# Altium schematic sheet car board ver1.SchDoc
size A2
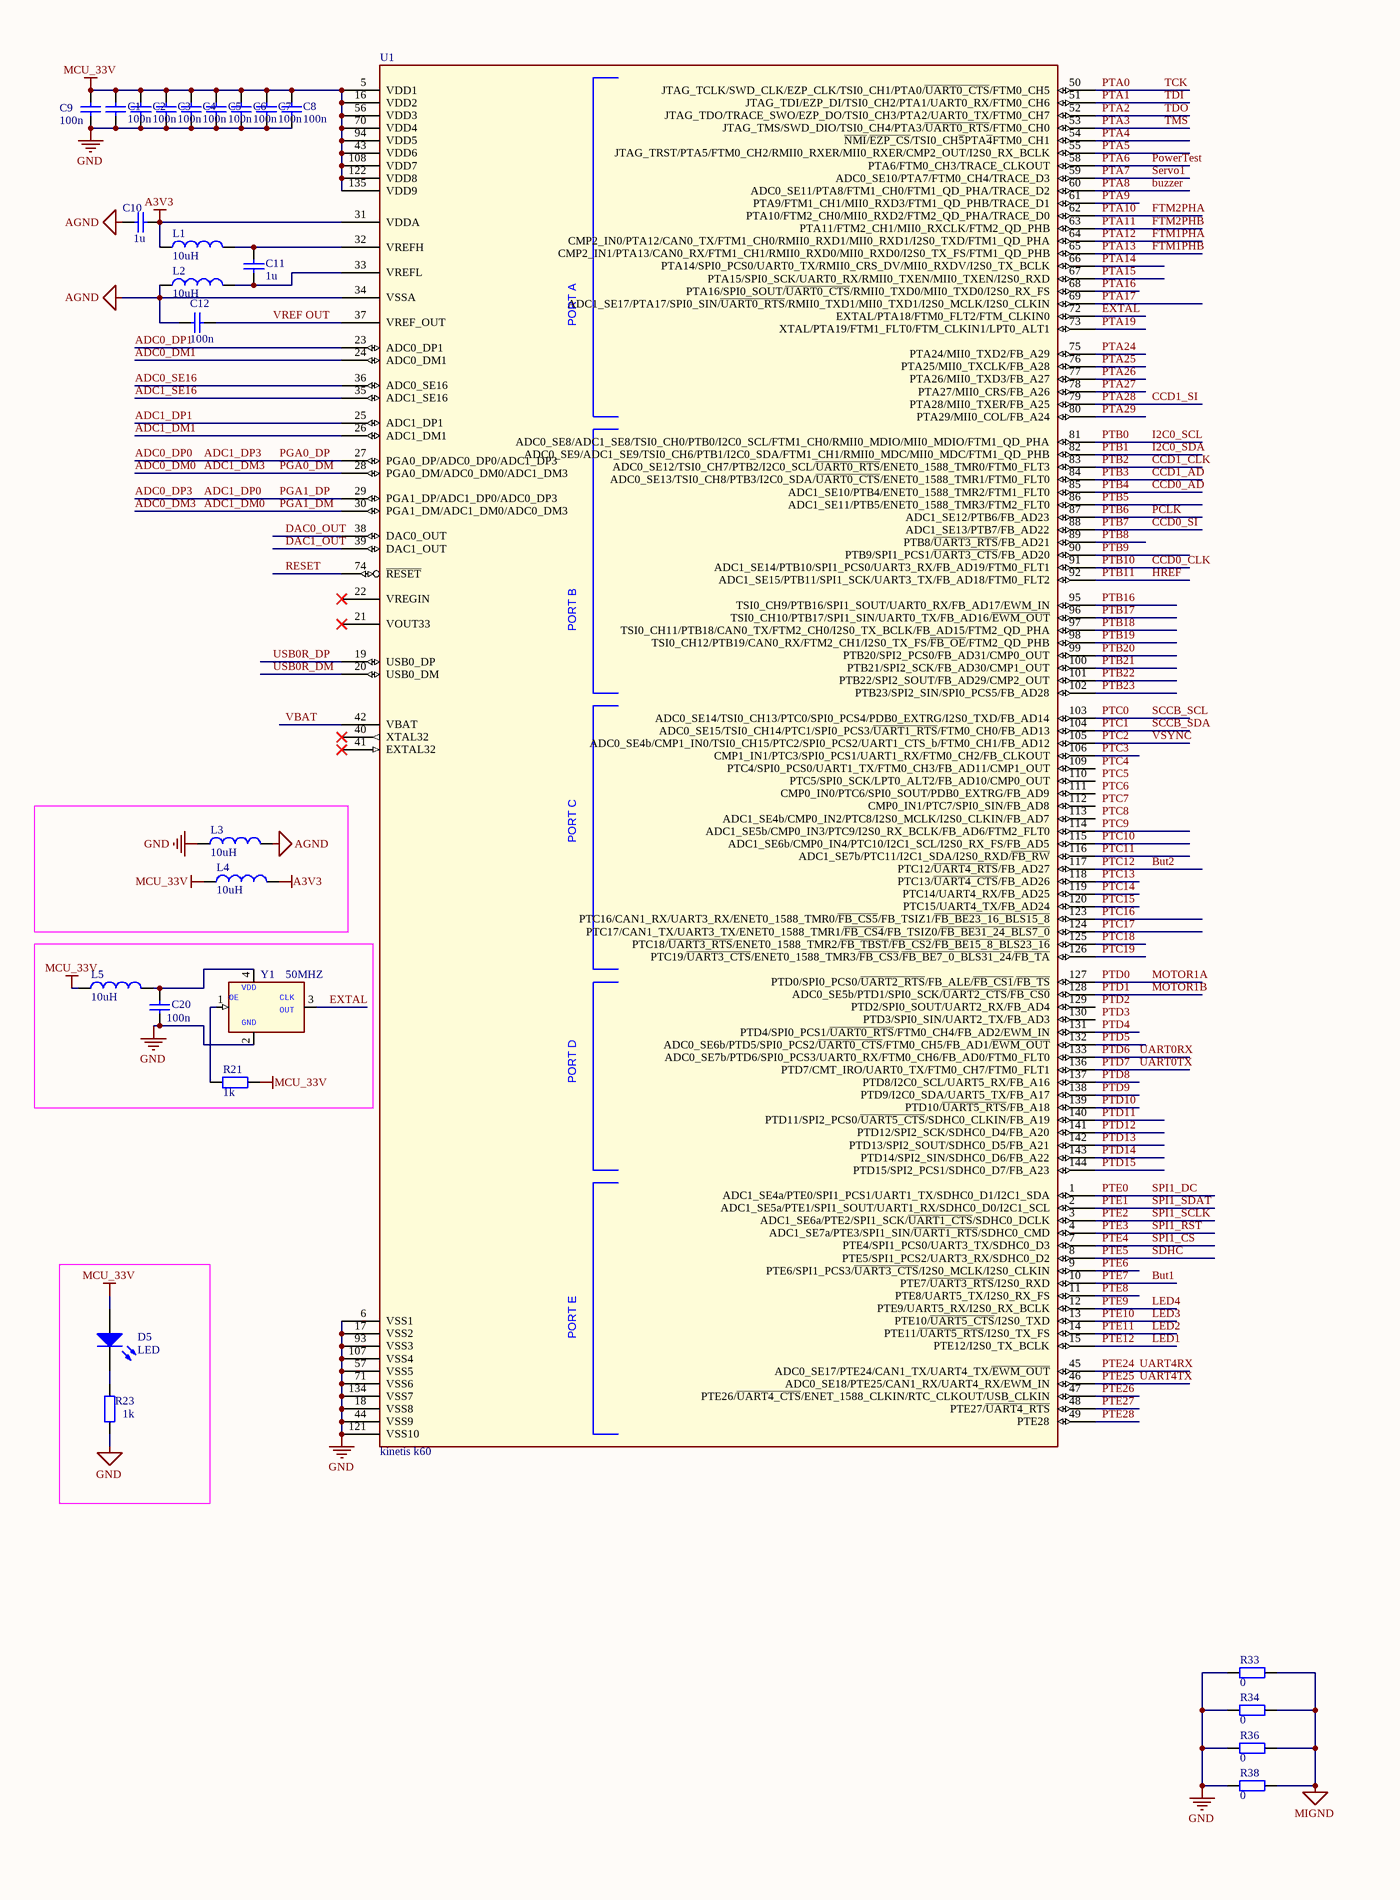
[diagram p0: car board ver1.SchDoc, left]
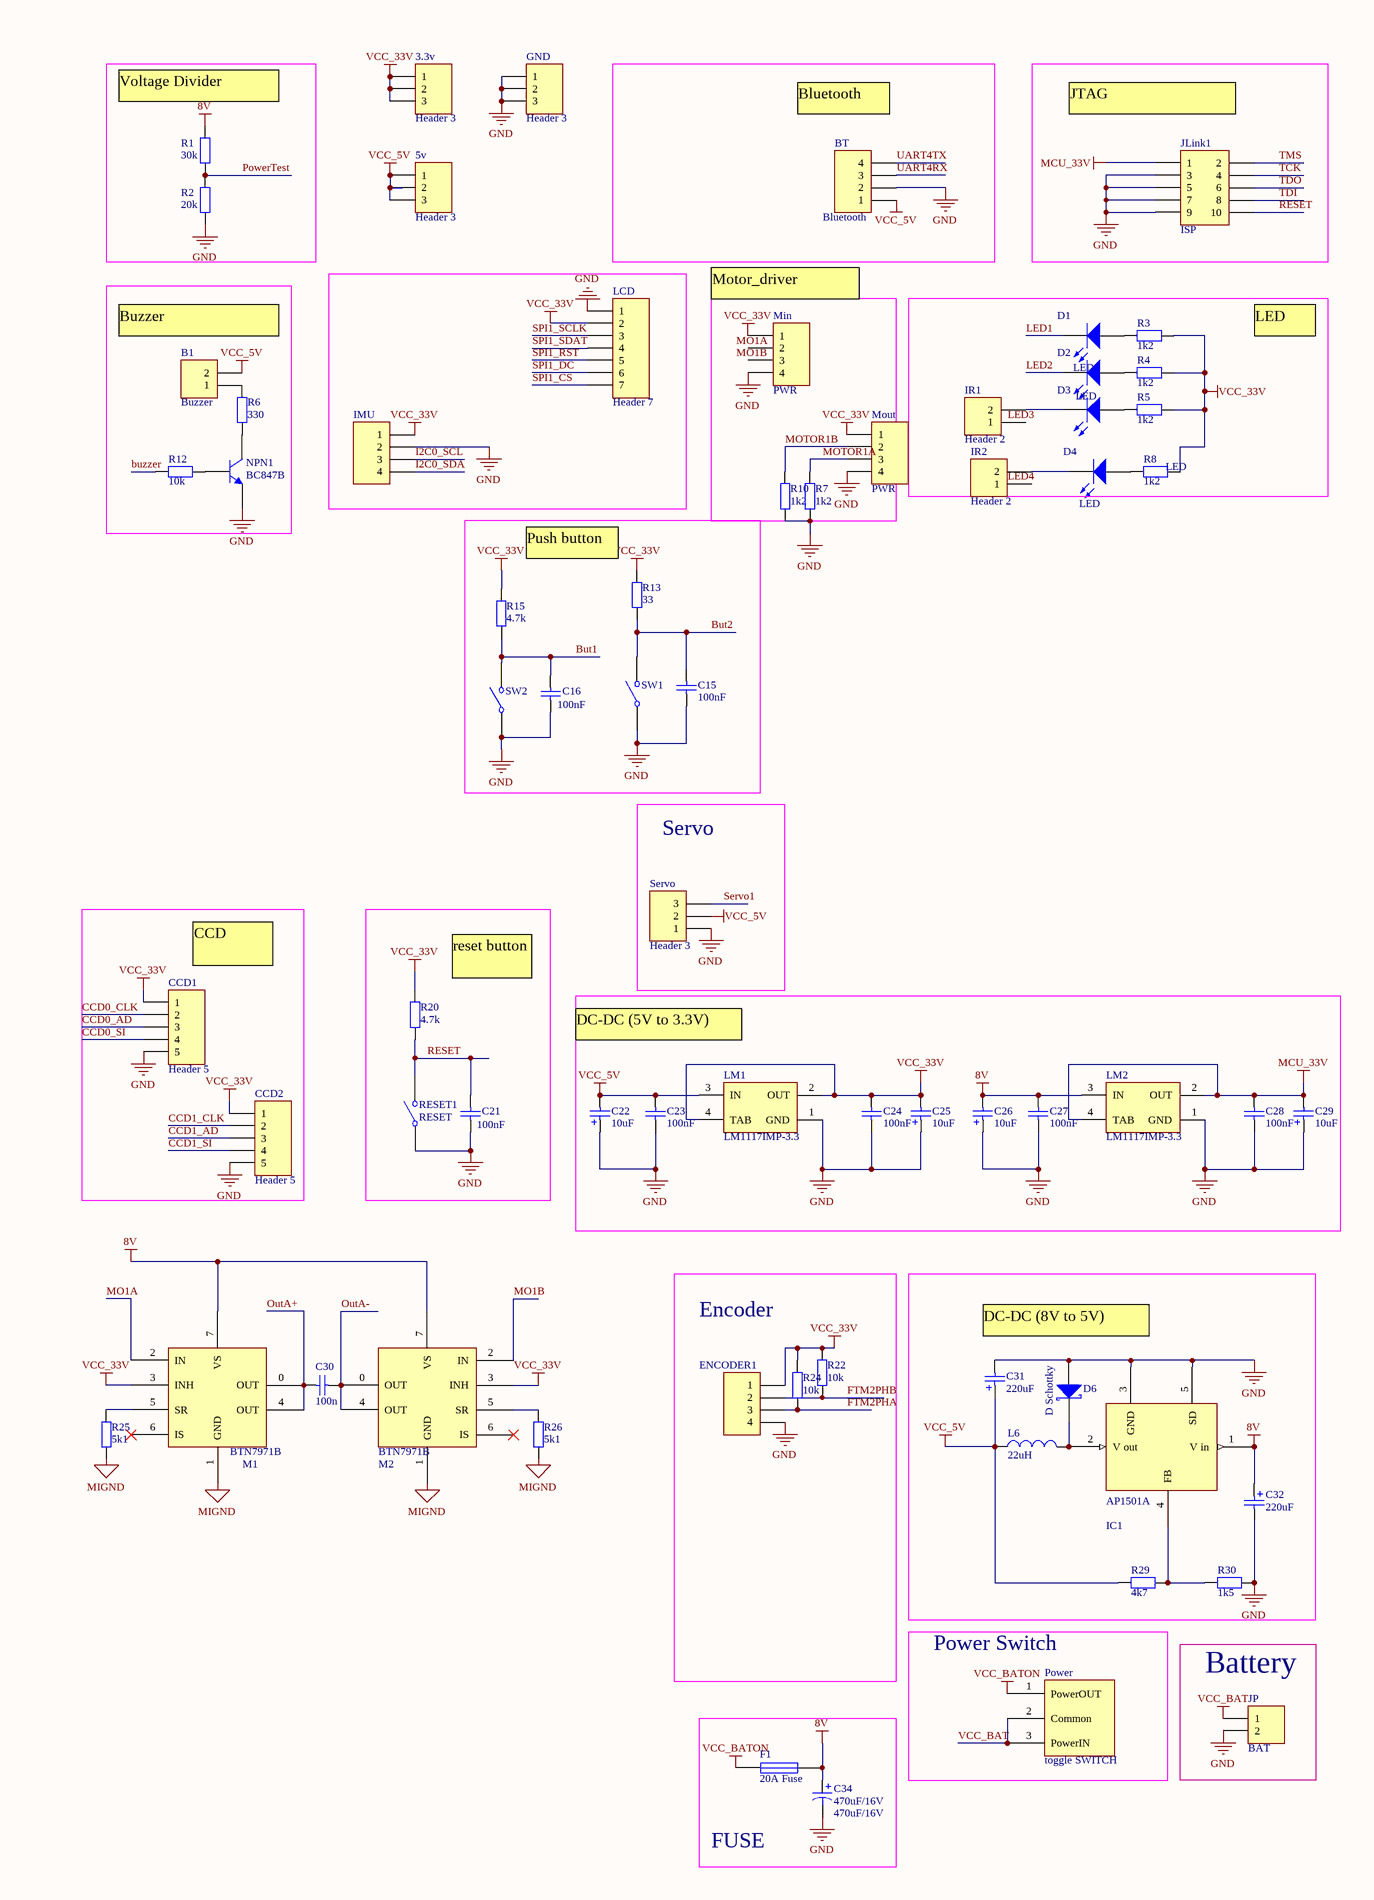
[diagram p1: car board ver1.SchDoc, right]

## Parts
3.3v  Header 3  [HDR1X3]
5v  Header 3  [HDR1X3]
B1  Buzzer  [Buzzer]
BT  Bluetooth  [6410-04]
C1  100n  [CC2012-0805]
C2  100n  [CC2012-0805]
C3  100n  [CC2012-0805]
C4  100n  [CC2012-0805]
C5  100n  [CC2012-0805]
C6  100n  [CC2012-0805]
C7  100n  [CC2012-0805]
C8  100n  [CC2012-0805]
C9  100n  [CC2012-0805]
C10  1u  [CC2012-0805]
C11  1u  [CC2012-0805]
C12  100n  [CC2012-0805]
C15  100nF  [CC2012-0805]
C16  100nF  [CC2012-0805]
C20  100n  [CC2012-0805]
C21  100nF  [CC2012-0805]
C22  10uF  [CC2012-0805]
C23  100nF  [CC2012-0805]
C24  100nF  [CC2012-0805]
C25  10uF  [CC2012-0805]
C26  10uF  [CC2012-0805]
C27  100nF  [CC2012-0805]
C28  100nF  [CC2012-0805]
C29  10uF  [CC2012-0805]
C30  100n  [CC2012-0805]
C31  220uF  [CAPC7238N]
C32  220uF  [CAPC7238N]
C34  470uF/16V  [SV-G]
CCD1  Header 5  [HDR1X5]
CCD2  Header 5  [HDR1X5]
D1  LED  [SMD _LED]
D2  LED  [SMD _LED]
D3  LED  [SMD _LED]
D4  LED  [SMD _LED]
D5  LED  [SMD _LED]
D6  D Schottky  [SMC]
ENCODER1  (no value)  [6410-04]
F1  20A Fuse  [FUSE]
GND  Header 3  [HDR1X3]
IC1  AP1501A  [TO-263(5)]
IMU  (no value)  [6410-04]
IR1  Header 2  [6410-02]
IR2  Header 2  [6410-02]
JLink1  ISP  [HDR2X5]
JP  BAT  [T-CONNECTOR (M)]
L1  10uH  [CR3225-1210]
L2  10uH  [CR3225-1210]
L3  10uH  [CR3225-1210]
L4  10uH  [CR3225-1210]
L5  10uH  [CR3225-1210]
L6  22uH  [CR3225-1210]
LCD  Header 7  [HDR1X7]
LM1  LM1117IMP-3.3  [MP04A_M]
LM2  LM1117IMP-3.3  [MP04A_M]
M1  BTN7971B  [TO-263(7)]
M2  BTN7971B  [TO-263(7)]
Min  PWR  [HDR1X4]
Mout  PWR  [HDR1X4]
NPN1  BC847B  [SOT-23]
Power  toggle SWITCH  [ToggleSwitch]
R1  30k  [CR2012-0805]
R2  20k  [CR2012-0805]
R3  1k2  [CR2012-0805]
R4  1k2  [CR2012-0805]
R5  1k2  [CR2012-0805]
R6  330  [CR2012-0805]
R7  1k2  [CR2012-0805]
R8  1k2  [CR2012-0805]
R10  1k2  [CR2012-0805]
R12  10k  [CR2012-0805]
R13  33  [CR2012-0805]
R15  value 4.7k  [CR2012-0805]  (hidden comment: 4k7)
R20  value 4.7k  [CR2012-0805]  (hidden comment: 4k7)
R21  1k  [CR2012-0805]
R22  10k  [CR2012-0805]
R23  1k  [CR2012-0805]
R24  10k  [CR2012-0805]
R25  5k1  [CR2012-0805]
R26  5k1  [CR2012-0805]
R29  4k7  [CR2012-0805]
R30  1k5  [CR2012-0805]
R33  0  [CR2012-0805]
R34  0  [CR2012-0805]
R36  0  [CR2012-0805]
R38  0  [CR2012-0805]
RESET1  RESET  [PUSHBUTTOM]
Servo  Header 3  [6410-03]
SW1  (no value)  [PUSHBUTTOM]
SW2  (no value)  [PUSHBUTTOM]
U1  kinetis k60  [LQFP50P2200X2200X160-144M]
Y1  50MHZ  [XTLOSC4_SM]

## Blocks framed on the sheet
Servo: Servo
Encoder: ENCODER1 R22 R24
Power Switch: Power
Battery: JP
FUSE: C34 F1

## Nets
8V: C26.2 C27.2 C32.1 C34.1 F1.2 IC1.1(V_in) LM2.3(IN) M1.7(VS) M2.7(VS) R1.2
A3V3: C10.2 L1.1 L4.2 U1.31(VDDA)
AGND: C10.1 C12.1 L2.1 L3.2 U1.34(VSSA)
GND: BT.2 C1.1 C2.1 C3.1 C4.1 C5.1 C6.1 C7.1 C8.1 C9.1 C15.1 C16.1 C20.2 C21.1 C22.1 C23.1 C24.1 C25.1 C26.1 C27.1 C28.1 C29.1 C31.2 C32.2 C34.2 CCD1.5 CCD2.5 D6.1(A) ENCODER1.4 GND.1 GND.2 GND.3 IC1.3(GND) IC1.5(SD) IMU.2 JLink1.3 JLink1.5 JLink1.7 JLink1.9 JP.2 L3.1 LCD.1 LM1.1(GND) LM2.1(GND) Min.4 Mout.4 NPN1.1(E) R2.1 R7.1 R10.1 R23.2 R30.2 R33.1 R34.1 R36.1 R38.1 RESET1.1(COMMON) Servo.1 SW1.1(COMMON) SW2.1(COMMON) U1.6(VSS1) U1.17(VSS2) U1.18(VSS8) U1.44(VSS9) U1.57(VSS5) U1.71(VSS6) U1.93(VSS3) U1.107(VSS4) U1.121(VSS10) U1.134(VSS7) Y1.2(GND)
MCU_33V: C1.2 C2.2 C3.2 C4.2 C5.2 C6.2 C7.2 C8.2 C9.2 C28.2 C29.2 D5.1(A) JLink1.1 L4.1 L5.1 LM2.2(OUT) LM2.4(TAB) R21.2 U1.5(VDD1) U1.16(VDD2) U1.43(VDD6) U1.56(VDD3) U1.70(VDD4) U1.94(VDD5) U1.108(VDD7) U1.122(VDD8) U1.135(VDD9)
MIGND: M1.1(GND) M2.1(GND) R25.1 R26.1 R33.2 R34.2 R36.2 R38.2
VCC_5V: 5v.1 5v.2 5v.3 B1.2 BT.1 C22.2 C23.2 C31.1 L6.1 LM1.3(IN) R29.1 Servo.2
VCC_33V: 3.3v.1 3.3v.2 3.3v.3 C24.2 C25.2 CCD1.1 CCD2.1 ENCODER1.1 IMU.1 LCD.2 LM1.2(OUT) LM1.4(TAB) M1.3(INH) M2.3(INH) Min.1 Mout.1 R3.2 R4.2 R5.2 R8.2 R13.1 R15.1 R20.1 R22.2 R24.2
VCC_BAT: JP.1 Power.2(Common) Power.3(PowerIN)
VCC_BATON: F1.1 Power.1(PowerOUT)
ADC0_DM0: U1.28(PGA0_DM/ADC0_DM0/ADC1_DM3)  [also labelled ADC1_DM3, PGA0_DM]
ADC0_DM1: U1.24(ADC0_DM1)
ADC0_DM3: U1.30(PGA1_DM/ADC1_DM0/ADC0_DM3)  [also labelled ADC1_DM0, PGA1_DM]
ADC0_DP0: U1.27(PGA0_DP/ADC0_DP0/ADC1_DP3)  [also labelled ADC1_DP3, PGA0_DP]
ADC0_DP1: U1.23(ADC0_DP1)
ADC0_DP3: U1.29(PGA1_DP/ADC1_DP0/ADC0_DP3)  [also labelled ADC1_DP0, PGA1_DP]
ADC0_SE16: U1.36(ADC0_SE16)
ADC1_DM1: U1.26(ADC1_DM1)
ADC1_DP1: U1.25(ADC1_DP1)
ADC1_SE16: U1.35(ADC1_SE16)
But1: C16.2 R15.2 SW2.2(NO) U1.10(PTE7/~{UART3_RTS}/I2S0_RXD)  [also labelled PTE7]
But2: C15.2 R13.2 SW1.2(NO) U1.117(PTC12/~{UART4_RTS}/FB_AD27)  [also labelled PTC12]
buzzer: R12.1 U1.60(ADC0_SE11/PTA8/FTM1_CH0/FTM1_QD_PHA/TRACE_D2)  [also labelled PTA8]
CCD0_AD: CCD1.3 U1.85(ADC1_SE10/PTB4/ENET0_1588_TMR2/FTM1_FLT0)  [also labelled PTB4]
CCD0_CLK: CCD1.2 U1.91(ADC1_SE14/PTB10/SPI1_PCS0/UART3_RX/FB_AD19/FTM0_FLT1)  [also labelled PTB10]
CCD0_SI: CCD1.4 U1.88(ADC1_SE13/PTB7/FB_AD22)  [also labelled PTB7]
CCD1_AD: CCD2.3 U1.84(ADC0_SE13/TSI0_CH8/PTB3/I2C0_SDA/~{UART0_CTS}/ENET0_1588_TMR1/FTM0_FLT0)  [also labelled PTB3]
CCD1_CLK: CCD2.2 U1.83(ADC0_SE12/TSI0_CH7/PTB2/I2C0_SCL/~{UART0_RTS}/ENET0_1588_TMR0/FTM0_FLT3)  [also labelled PTB2]
CCD1_SI: CCD2.4 U1.79(PTA28/MII0_TXER/FB_A25)  [also labelled PTA28]
DAC0_OUT: U1.38(DAC0_OUT)
DAC1_OUT: U1.39(DAC1_OUT)
EXTAL: U1.72(EXTAL/PTA18/FTM0_FLT2/FTM_CLKIN0) Y1.3(CLKOUT)
FTM1PHA: U1.64(CMP2_IN0/PTA12/CAN0_TX/FTM1_CH0/RMII0_RXD1/MII0_RXD1/I2S0_TXD/FTM1_QD_PHA)  [also labelled PTA12]
FTM1PHB: U1.65(CMP2_IN1/PTA13/CAN0_RX/FTM1_CH1/RMII0_RXD0/MII0_RXD0/I2S0_TX_FS/FTM1_QD_PHB)  [also labelled PTA13]
FTM2PHA: ENCODER1.3 R24.1 U1.62(PTA10/FTM2_CH0/MII0_RXD2/FTM2_QD_PHA/TRACE_D0)  [also labelled PTA10]
FTM2PHB: ENCODER1.2 R22.1 U1.63(PTA11/FTM2_CH1/MII0_RXCLK/FTM2_QD_PHB)  [also labelled PTA11]
HREF: U1.92(ADC1_SE15/PTB11/SPI1_SCK/UART3_TX/FB_AD18/FTM0_FLT2)  [also labelled PTB11]
I2C0_SCL: IMU.3 U1.81(ADC0_SE8/ADC1_SE8/TSI0_CH0/PTB0/I2C0_SCL/FTM1_CH0/RMII0_MDIO/MII0_MDIO/FTM1_QD_PHA)  [also labelled PTB0]
I2C0_SDA: IMU.4 U1.82(ADC0_SE9/ADC1_SE9/TSI0_CH6/PTB1/I2C0_SDA/FTM1_CH1/RMII0_MDC/MII0_MDC/FTM1_QD_PHB)  [also labelled PTB1]
LED1: D1.2(K) U1.15(PTE12/I2S0_TX_BCLK)  [also labelled PTE12]
LED2: D2.2(K) U1.14(PTE11/~{UART5_RTS}/I2S0_TX_FS)  [also labelled PTE11]
LED3: U1.13(PTE10/~{UART5_CTS}/I2S0_TXD)  [also labelled PTE10]
LED4: U1.12(PTE9/UART5_RX/I2S0_RX_BCLK)  [also labelled PTE9]
MO1A: M1.2(IN)
MO1B: M2.2(IN)
MOTOR1A: Mout.3 R7.2 U1.127(PTD0/SPI0_PCS0/~{UART2_RTS}/FB_ALE/~{FB_CS1}/~{FB_TS})  [also labelled PTD0]
MOTOR1B: Mout.2 R10.2 U1.128(ADC0_SE5b/PTD1/SPI0_SCK/~{UART2_CTS}/~{FB_CS0})  [also labelled PTD1]
OutA+: C30.1 M1.0(OUT) M1.4(OUT)
OutA-: C30.2 M2.0(OUT) M2.4(OUT)
PCLK: U1.87(ADC1_SE12/PTB6/FB_AD23)  [also labelled PTB6]
PowerTest: R1.1 R2.2 U1.58(PTA6/FTM0_CH3/TRACE_CLKOUT)  [also labelled PTA6]
PTA0: JLink1.4 U1.50(JTAG_TCLK/SWD_CLK/EZP_CLK/TSI0_CH1/PTA0/~{UART0_CTS}/FTM0_CH5)  [also labelled TCK]
PTA1: JLink1.8 U1.51(JTAG_TDI/EZP_DI/TSI0_CH2/PTA1/UART0_RX/FTM0_CH6)  [also labelled TDI]
PTA2: JLink1.6 U1.52(JTAG_TDO/TRACE_SWO/EZP_DO/TSI0_CH3/PTA2/UART0_TX/FTM0_CH7)  [also labelled TDO]
PTA3: JLink1.2 U1.53(JTAG_TMS/SWD_DIO/TSI0_CH4/PTA3/~{UART0_RTS}/FTM0_CH0)  [also labelled TMS]
PTA4: U1.54(~{NMI}/~{EZP_CS}/TSI0_CH~{5}PTA~{4}FTM0_CH1)
PTA5: U1.55(JTAG_TRST/PTA5/FTM0_CH2/RMII0_RXER/MII0_RXER/CMP2_OUT/I2S0_RX_BCLK)
PTA7: Servo.3 U1.59(ADC0_SE10/PTA7/FTM0_CH4/TRACE_D3)  [also labelled Servo1]
PTA9: U1.61(PTA9/FTM1_CH1/MII0_RXD3/FTM1_QD_PHB/TRACE_D1)
PTA14: U1.66(PTA14/SPI0_PCS0/UART0_TX/RMII0_CRS_DV/MII0_RXDV/I2S0_TX_BCLK)
PTA15: U1.67(PTA15/SPI0_SCK/UART0_RX/RMII0_TXEN/MII0_TXEN/I2S0_RXD)
PTA16: U1.68(PTA16/SPI0_SOUT/~{UART0_CTS}/RMII0_TXD0/MII0_TXD0/I2S0_RX_FS)
PTA17: U1.69(ADC1_SE17/PTA17/SPI0_SIN/~{UART0_RTS}/RMII0_TXD1/MII0_TXD1/I2S0_MCLK/I2S0_CLKIN)
PTA19: U1.73(XTAL/PTA19/FTM1_FLT0/FTM_CLKIN1/LPT0_ALT1)
PTA24: U1.75(PTA24/MII0_TXD2/FB_A29)
PTA25: U1.76(PTA25/MII0_TXCLK/FB_A28)
PTA26: U1.77(PTA26/MII0_TXD3/FB_A27)
PTA27: U1.78(PTA27/MII0_CRS/FB_A26)
PTA29: U1.80(PTA29/MII0_COL/FB_A24)
PTB5: U1.86(ADC1_SE11/PTB5/ENET0_1588_TMR3/FTM2_FLT0)
PTB8: U1.89(PTB8/~{UART3_RTS}/FB_AD21)
PTB9: U1.90(PTB9/SPI1_PCS1/~{UART3_CTS}/FB_AD20)
PTB16: U1.95(TSI0_CH9/PTB16/SPI1_SOUT/UART0_RX/FB_AD17/EWM_IN)
PTB17: U1.96(TSI0_CH10/PTB17/SPI1_SIN/UART0_TX/FB_AD16/~{EWM_OUT})
PTB18: U1.97(TSI0_CH11/PTB18/CAN0_TX/FTM2_CH0/I2S0_TX_BCLK/FB_AD15/FTM2_QD_PHA)
PTB19: U1.98(TSI0_CH12/PTB19/CAN0_RX/FTM2_CH1/I2S0_TX_FS/~{FB_OE}/FTM2_QD_PHB)
PTB20: U1.99(PTB20/SPI2_PCS0/FB_AD31/CMP0_OUT)
PTB21: U1.100(PTB21/SPI2_SCK/FB_AD30/CMP1_OUT)
PTB22: U1.101(PTB22/SPI2_SOUT/FB_AD29/CMP2_OUT)
PTB23: U1.102(PTB23/SPI2_SIN/SPI0_PCS5/FB_AD28)
PTC0: U1.103(ADC0_SE14/TSI0_CH13/PTC0/SPI0_PCS4/PDB0_EXTRG/I2S0_TXD/FB_AD14)  [also labelled SCCB_SCL]
PTC1: U1.104(ADC0_SE15/TSI0_CH14/PTC1/SPI0_PCS3/~{UART1_RTS}/FTM0_CH0/FB_AD13)  [also labelled SCCB_SDA]
PTC2: U1.105(ADC0_SE4b/CMP1_IN0/TSI0_CH15/PTC2/SPI0_PCS2/UART1_CTS_b/FTM0_CH1/FB_AD12)  [also labelled VSYNC]
PTC3: U1.106(CMP1_IN1/PTC3/SPI0_PCS1/UART1_RX/FTM0_CH2/FB_CLKOUT)
PTC9: U1.114(ADC1_SE5b/CMP0_IN3/PTC9/I2S0_RX_BCLK/FB_AD6/FTM2_FLT0)
PTC10: U1.115(ADC1_SE6b/CMP0_IN4/PTC10/I2C1_SCL/I2S0_RX_FS/FB_AD5)
PTC11: U1.116(ADC1_SE7b/PTC11/I2C1_SDA/I2S0_RXD/~{FB_RW})
PTC13: U1.118(PTC13/~{UART4_CTS}/FB_AD26)
PTC14: U1.119(PTC14/UART4_RX/FB_AD25)
PTC15: U1.120(PTC15/UART4_TX/FB_AD24)
PTC16: U1.123(PTC16/CAN1_RX/UART3_RX/ENET0_1588_TMR0/~{FB_CS5}/FB_TSIZ1/~{FB_BE23_16_BLS15_8})
PTC17: U1.124(PTC17/CAN1_TX/UART3_TX/ENET0_1588_TMR1/~{FB_CS4}/FB_TSIZ0/~{FB_BE31_24_BLS7_0})
PTC18: U1.125(PTC18/~{UART3_RTS}/ENET0_1588_TMR2/~{FB_TBST}/~{FB_CS2}/~{FB_BE15_8_BLS23_16})
PTC19: U1.126(PTC19/~{UART3_CTS}/ENET0_1588_TMR3/~{FB_CS3}/~{FB_BE7_0_BLS31_24}/~{FB_TA})
PTD4: U1.131(PTD4/SPI0_PCS1/~{UART0_RTS}/FTM0_CH4/FB_AD2/EWM_IN)
PTD5: U1.132(ADC0_SE6b/PTD5/SPI0_PCS2/~{UART0_CTS}/FTM0_CH5/FB_AD1/~{EWM_OUT})
PTD6: U1.133(ADC0_SE7b/PTD6/SPI0_PCS3/UART0_RX/FTM0_CH6/FB_AD0/FTM0_FLT0)  [also labelled UART0RX]
PTD7: U1.136(PTD7/CMT_IRO/UART0_TX/FTM0_CH7/FTM0_FLT1)  [also labelled UART0TX]
PTD8: U1.137(PTD8/I2C0_SCL/UART5_RX/FB_A16)
PTD9: U1.138(PTD9/I2C0_SDA/UART5_TX/FB_A17)
PTD10: U1.139(PTD10/~{UART5_RTS}/FB_A18)
PTD11: U1.140(PTD11/SPI2_PCS0/~{UART5_CTS}/SDHC0_CLKIN/FB_A19)
PTD12: U1.141(PTD12/SPI2_SCK/SDHC0_D4/FB_A20)
PTD13: U1.142(PTD13/SPI2_SOUT/SDHC0_D5/FB_A21)
PTD14: U1.143(PTD14/SPI2_SIN/SDHC0_D6/FB_A22)
PTD15: U1.144(PTD15/SPI2_PCS1/SDHC0_D7/FB_A23)
PTE0: LCD.6 U1.1(ADC1_SE4a/PTE0/SPI1_PCS1/UART1_TX/SDHC0_D1/I2C1_SDA)  [also labelled SPI1_DC]
PTE1: LCD.4 U1.2(ADC1_SE5a/PTE1/SPI1_SOUT/UART1_RX/SDHC0_D0/I2C1_SCL)  [also labelled SPI1_SDAT]
PTE2: LCD.3 U1.3(ADC1_SE6a/PTE2/SPI1_SCK/~{UART1_CTS}/SDHC0_DCLK)  [also labelled SPI1_SCLK]
PTE3: LCD.5 U1.4(ADC1_SE7a/PTE3/SPI1_SIN/~{UART1_RTS}/SDHC0_CMD)  [also labelled SPI1_RST]
PTE4: LCD.7 U1.7(PTE4/SPI1_PCS0/UART3_TX/SDHC0_D3)  [also labelled SPI1_CS]
PTE5: U1.8(PTE5/SPI1_PCS2/UART3_RX/SDHC0_D2)  [also labelled SDHC]
PTE6: U1.9(PTE6/SPI1_PCS3/~{UART3_CTS}/I2S0_MCLK/I2S0_CLKIN)
PTE8: U1.11(PTE8/UART5_TX/I2S0_RX_FS)
PTE24: BT.3 U1.45(ADC0_SE17/PTE24/CAN1_TX/UART4_TX/~{EWM_OUT})  [also labelled UART4RX]
PTE25: BT.4 U1.46(ADC0_SE18/PTE25/CAN1_RX/UART4_RX/EWM_IN)  [also labelled UART4TX]
PTE26: U1.47(PTE26/~{UART4_CTS}/ENET_1588_CLKIN/RTC_CLKOUT/USB_CLKIN)
PTE27: U1.48(PTE27/~{UART4_RTS})
PTE28: U1.49(PTE28)
RESET: C21.2 JLink1.10 R20.2 RESET1.2(NO) U1.74(~{RESET})
USB0R_DM: U1.20(USB0_DM)
USB0R_DP: U1.19(USB0_DP)
VBAT: U1.42(VBAT)
VREF OUT: C12.2 U1.37(VREF_OUT)
NetB1_1: B1.1 R6.1
NetC11_1: C11.1 L2.2 U1.33(VREFL)
NetC11_2: C11.2 L1.2 U1.32(VREFH)
NetC20_1: C20.1 L5.2 Y1.4(VDD)
NetD1_1: D1.1(A) R3.1
NetD2_1: D2.1(A) R4.1
NetD3_1: D3.1(A) R5.1
NetD3_2: D3.2(K) IR1.2
NetD4_1: D4.1(A) R8.1
NetD4_2: D4.2(K) IR2.2
NetD5_2: D5.2(K) R23.1
NetD6_2: D6.2(K) IC1.2(V_out) L6.2
NetIC1_4: IC1.4(FB) R29.2 R30.1
NetM1_5: M1.5(SR) R25.2
NetM2_5: M2.5(SR) R26.2
NetNPN1_2: NPN1.2(B) R12.2
NetNPN1_3: NPN1.3(C) R6.2
NetR21_1: R21.1 Y1.1(OE)

Not connected (* = marked no-connect by the designer): IR1 1; IR2 1; M1 6(IS)*; M2 6(IS)*; Min 2 3; U1 21(VOUT33)* 22(VREGIN)* 40(XTAL32)* 41(EXTAL32)* 109(PTC4/SPI0_PCS0/UART1_TX/FTM0_CH3/FB_AD11/CMP1_OUT) 110(PTC5/SPI0_SCK/LPT0_ALT2/FB_AD10/CMP0_OUT) 111(CMP0_IN0/PTC6/SPI0_SOUT/PDB0_EXTRG/FB_AD9) 112(CMP0_IN1/PTC7/SPI0_SIN/FB_AD8) 113(ADC1_SE4b/CMP0_IN2/PTC8/I2S0_MCLK/I2S0_CLKIN/FB_AD7) 129(PTD2/SPI0_SOUT/UART2_RX/FB_AD4) 130(PTD3/SPI0_SIN/UART2_TX/FB_AD3)

## Notes on the sheet
- (near R1) Voltage Divider
- Bluetooth
- JTAG
- (near B1) Buzzer
- (near Min) Motor_driver
- LED
- Push button
- (near CCD1) CCD
- (near R20) reset button
- DC-DC (5V to 3.3V)
- DC-DC (8V to 5V)
- Labels drawn without touching a wire or pin: LED3, LED4, MO1A, MO1B, PTC4, PTC5, PTC6, PTC7, PTC8, PTD2, PTD3
- (in symbol CLKGEN-SM) CLK; OUT
- (in symbol kinetis k60) PORT A; PORT B; PORT C; PORT D; PORT E

## Library data of the parts
3.3v 5v GND Servo = Header 3: Header, 3-Pin; LatestRevisionDate: 17-Jul-2002; LatestRevisionNote: Re-released for DXP Platform.; Publisher: Altium Limited
BT ENCODER1 IMU Min Mout = Header 4: Header, 4-Pin; Publisher: Altium Limited
  BT Min Mout: LatestRevisionDate: 17-Jul-2002; LatestRevisionNote: Re-released for DXP Platform.
  ENCODER1 IMU: Revision: 17-Jul-2002: Re-released for DXP Platform.
C1-C12 C15 C16 C20 C21 C23 C24 C27 C28 = Cap Semi: Capacitor (Semiconductor SIM Model); Published: 8-Jun-2000; LatestRevisionDate: 17-Jul-2002; LatestRevisionNote: Re-released for DXP Platform.; PackageReference: C1206; Publisher: Altium Limited
  C16 C21: value: 100nF
C22 C25 C26 C29 = Cap Pol3: Polarized Capacitor (Surface Mount); Published: 8-Jun-2000; LatestRevisionDate: 17-Jul-2002; LatestRevisionNote: Re-released for DXP Platform.; PackageReference: C0805; Publisher: Altium Limited
C30 = Cap: Capacitor; Published: 8-Jun-2000; LatestRevisionDate: 17-Jul-2002; LatestRevisionNote: Re-released for DXP Platform.; Publisher: Altium Limited
C31 C32 = Cap Pol1: Polarized Capacitor (Radial); Published: 8-Jun-2000; LatestRevisionDate: 17-Jul-2002; LatestRevisionNote: Re-released for DXP Platform.; Publisher: Altium Limited
C34 = Cap Pol2: Polarized Capacitor (Axial); Published: 8-Jun-2000; Revision: July-2002: Re-released for DXP Platform.; Publisher: Altium Limited; Value: 470uF/16V
CCD1 CCD2 = Header 5: Header, 5-Pin; LatestRevisionDate: 17-Jul-2002; LatestRevisionNote: Re-released for DXP Platform.; Publisher: Altium Limited
D1-D5 = LED: Typical RED GaAs LED; Published: 8-Jun-2000; LatestRevisionDate: 08-Jul-2005; LatestRevisionNote: Mech Layer 1 removed.; PackageReference: LED-1; Publisher: Altium Limited
D6 = D Schottky: Schottky Diode; Code - JEDEC: DO-214-AA; Published: 8-Jun-2000; Revision: July-2002: Re-released for DXP Platform.; Publisher: Altium Limited
F1 = Fuse: Published: 8-Jun-2000; Revision: July-2002: Re-released for DXP Platform.; Publisher: Altium Limited
IC1 = AP1501A: 5A Step-Down Switching Mode Voltage Regulator
IR1 IR2 JP = Header 2: Header, 2-Pin; Publisher: Altium Limited
  IR1 IR2: LatestRevisionDate: 17-Jul-2002; LatestRevisionNote: Re-released for DXP Platform.
  JP: Revision: 17-Jul-2002: Re-released for DXP Platform.
JLink1 = Header 5X2: Header, 5-Pin, Dual row; Revision: 17-Jul-2002: Re-released for DXP Platform.; Publisher: Altium Limited
L1-L6 = Inductor: Published: 8-Jun-2000; Revision: July-2002: Re-released for DXP Platform.; Publisher: Altium Limited
  L1-L5: Value: 10uH
  L6: Value: 22uH
LCD = Header 7: Header, 7-Pin; LatestRevisionDate: 17-Jul-2002; LatestRevisionNote: Re-released for DXP Platform.; Publisher: Altium Limited
LM1 LM2 = LM1117IMP-3.3: 800mA Low-Dropout Linear Regulator; Manufacturer: National Semiconductor; CompType: LDO IC; PackageTopMarking: XYTT*N05B; PowerWise: N; Published: 4-Dec-2008; DatasheetVersion: Apr-2006; PackageVersion: revB, Apr-2003; PackageReference: MP04A; Publisher: Altium Limited; PackageDescription: Molded SOT-223, 6.50 x 3.56 x 1.6mm Body, 4 Lead, 2.3mm Pitch; PartNumber: LM1117IMP-3.3; RoHS: O; PinCount: 4; DigiKeyPartNumber: LM1117IMP-3.3CT-ND; Code_JEDEC: TO-261-AA; Code_IPC: SOT223-4; ComponentLink1Description: LM1117 Datasheet; ComponentLink1URL: http://www.national.com/ds/LM/LM1117.pdf; ComponentLink2Description: LM1117 Web Page; ComponentLink2URL: http://www.national.com/pf/LM/LM1117.html; ComponentLink3Description: MP04A Package Page; ComponentLink3URL: http://www.national.com/packaging/folders/mp04a.html
M1 M2 = BTS 7970B
NPN1 = BC847B: NPN
R1-R8 R10 R12 R13 R15 R20-R26 R29 R30 R33 R34 R36 R38 = Res2: Resistor; Published: 8-Jun-2000; Revision: July-2002: Re-released for DXP Platform.; Publisher: Altium Limited
  R1: Value: 30k
  R2: Value: 20k
  R3-R5 R7 R8 R10: Value: 1k2
  R6: Value: 330
  R12 R22 R24: Value: 10k
  R13: Value: 33
  R21 R23: Value: 1k
  R25 R26: Value: 5k1
  R29: Value: 4k7
  R30: Value: 1k5
  R33 R34 R36 R38: Value: 0
RESET1 SW1 SW2 = SW-SPST: Single-Pole, Single-Throw Switch; Published: 24-Mar-1999; Revision: July-2002: Re-released for DXP Platform.; Publisher: Altium Limited
U1 = kinetis k60: CLASS: IC
Y1 = CLKGEN-SM: CLASS: IC